# Altium schematic sheet Схема блока SD.SchDoc
size 420 x 297 mm; Address1: Address1; Address2: Address2; Address3: Address3; Address4: Address4; DocumentNumber: АБВГ.123456.001 Э3; SheetNumber: 1; Scale: 1:1; DocumentType: Схема электрическая принципиальная; FirstReferrence: АБВГ.123456.001
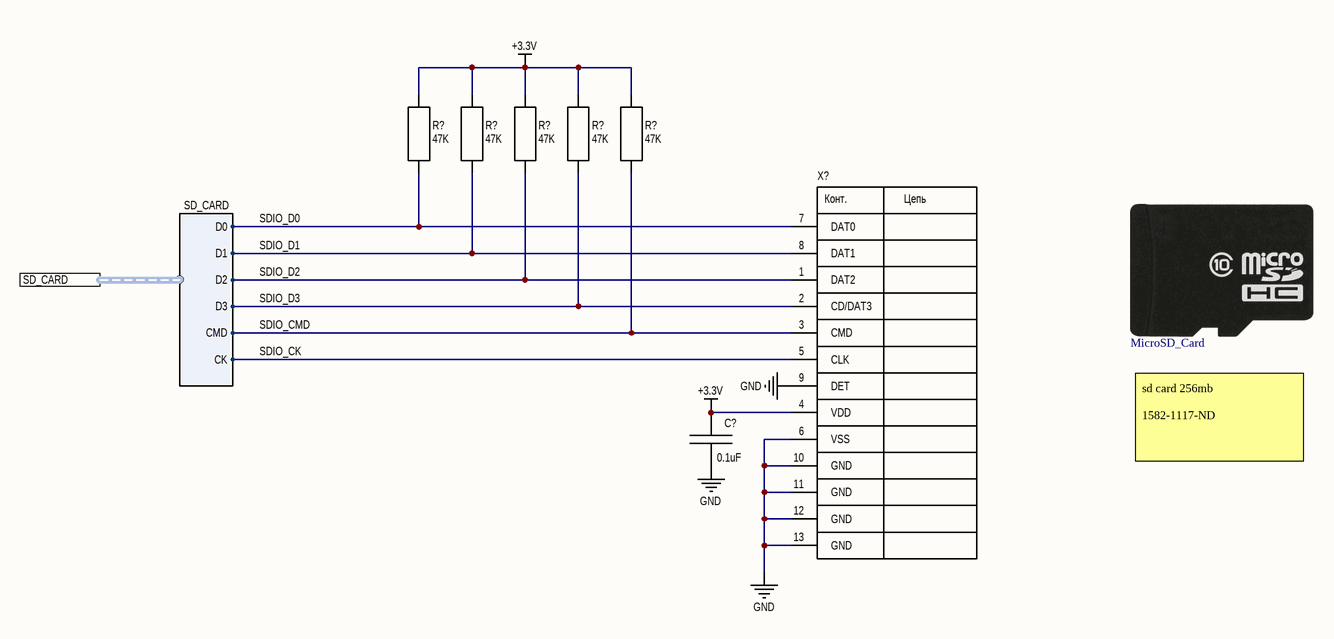
[diagram p0: Схема блока SD.SchDoc]

## Parts
(Parts that share a designator on the sheet are numbered #1, #2 ... from top to bottom, then left to right.)
*?  MicroSD_Card  (mechanical)
C?  0.1uF  [CH0603C]
R?#1  47K  [CH0603R]
R?#2  47K  [CH0603R]
R?#3  47K  [CH0603R]
R?#4  47K  [CH0603R]
R?#5  47K  [CH0603R]
X?  *  [CON: microSD]  (value not drawn)

## Ports
SD_CARD (harness SD_CARD)

## Harnesses
SD_CARD: D3, D0, D1, D2, CMD, CK

## Nets
+3.3V: C?.1 R?#1.2 R?#2.2 R?#3.2 R?#4.2 R?#5.2 X?.4(VDD)
GND: C?.2 X?.6(VSS) X?.9(DET) X?.10(GND) X?.11(GND) X?.12(GND) X?.13(GND)
SDIO_CK: X?.5(CLK) ; port SD_CARD.CK
SDIO_CMD: R?#5.1 X?.3(CMD) ; port SD_CARD.CMD
SDIO_D0: R?#1.1 X?.7(DAT0) ; port SD_CARD.D0
SDIO_D1: R?#2.1 X?.8(DAT1) ; port SD_CARD.D1
SDIO_D2: R?#3.1 X?.1(DAT2) ; port SD_CARD.D2
SDIO_D3: R?#4.1 X?.2(CD/DAT3) ; port SD_CARD.D3

## Notes on the sheet
- sd card 256mb
  1582-1117-ND
- Подп. и дата
- Инв. № дубл.
- Взам. инв. №
- Инв. № подл.
- Изм.
- Лист
- № докум.
- Подп.
- Дата
- 2.106-A3
- Копировал
- Формат А3
- (in symbol Connector MicroSD) Конт.; Цепь

## Library data of the parts
*? = MicroSD_Card: Manufacturer: Apacer; Manufacturer Part Number: AP-MSD256ISI-1T; Supplier 1: Digi-Key; Supplier Part Number 1: 1582-1117-ND; Stock 1: 4143; Pricing 1: 1=12.85, 10=11.903, 25=11.6336, 50=11.5698, 100=10.1856, 250=9.68168, 500=9.5823, 1000=9.26289 (USD); ComponentLink1URL: http://www.mouser.com/ds/2/24/EDM_mSD(SLC)-957981.pdf; ComponentLink1Description: http://www.mouser.com/ds/2/24/EDM_mSD(SLC)-957981.pdf; ComponentLink2URL: http://eflash.apacerus.com/spec/Card/microSD/Consumer/EDM_mSD(SLC).pdf; ComponentLink2Description: http://eflash.apacerus.com/spec/Card/microSD/Consumer/EDM_mSD(SLC).pdf
C? = Capacitor: Manufacturer: KEMET; Model: C0603C104K5RAC7867; HelpURL: https://www.digikey.com/en/products/detail/kemet/C0603C104K5RAC7867/1465594?s=N4IgTCBcDaIMIAYBsCDMcCMCAsBpArAEoCCcAKgKogC6AvkA; ComponentKind: 0603 (1608 Metric); Value: 0.1uF
R?#1-R?#5 = Resistor: Manufacturer: Panasonic Electronic Components; Model: ERJ-3EKF4702V; HelpURL: https://www.digikey.com/en/products/detail/panasonic-electronic-components/ERJ-3EKF4702V/1746421?s=N4IgTCBcDaIKICUBSBaAzHA0gMQCwHYAGMANRAF0BfIA; ComponentKind: 0603 (1608 Metric); Value: 47K
X? = Connector MicroSD: MicroSD; Model: *; Manufacturer: *; HelpURL: *; ComponentKind: *